# EAGLE design firefly-instrument-controller (EAGLE 7.7.0)

## Sheet 1 of 4
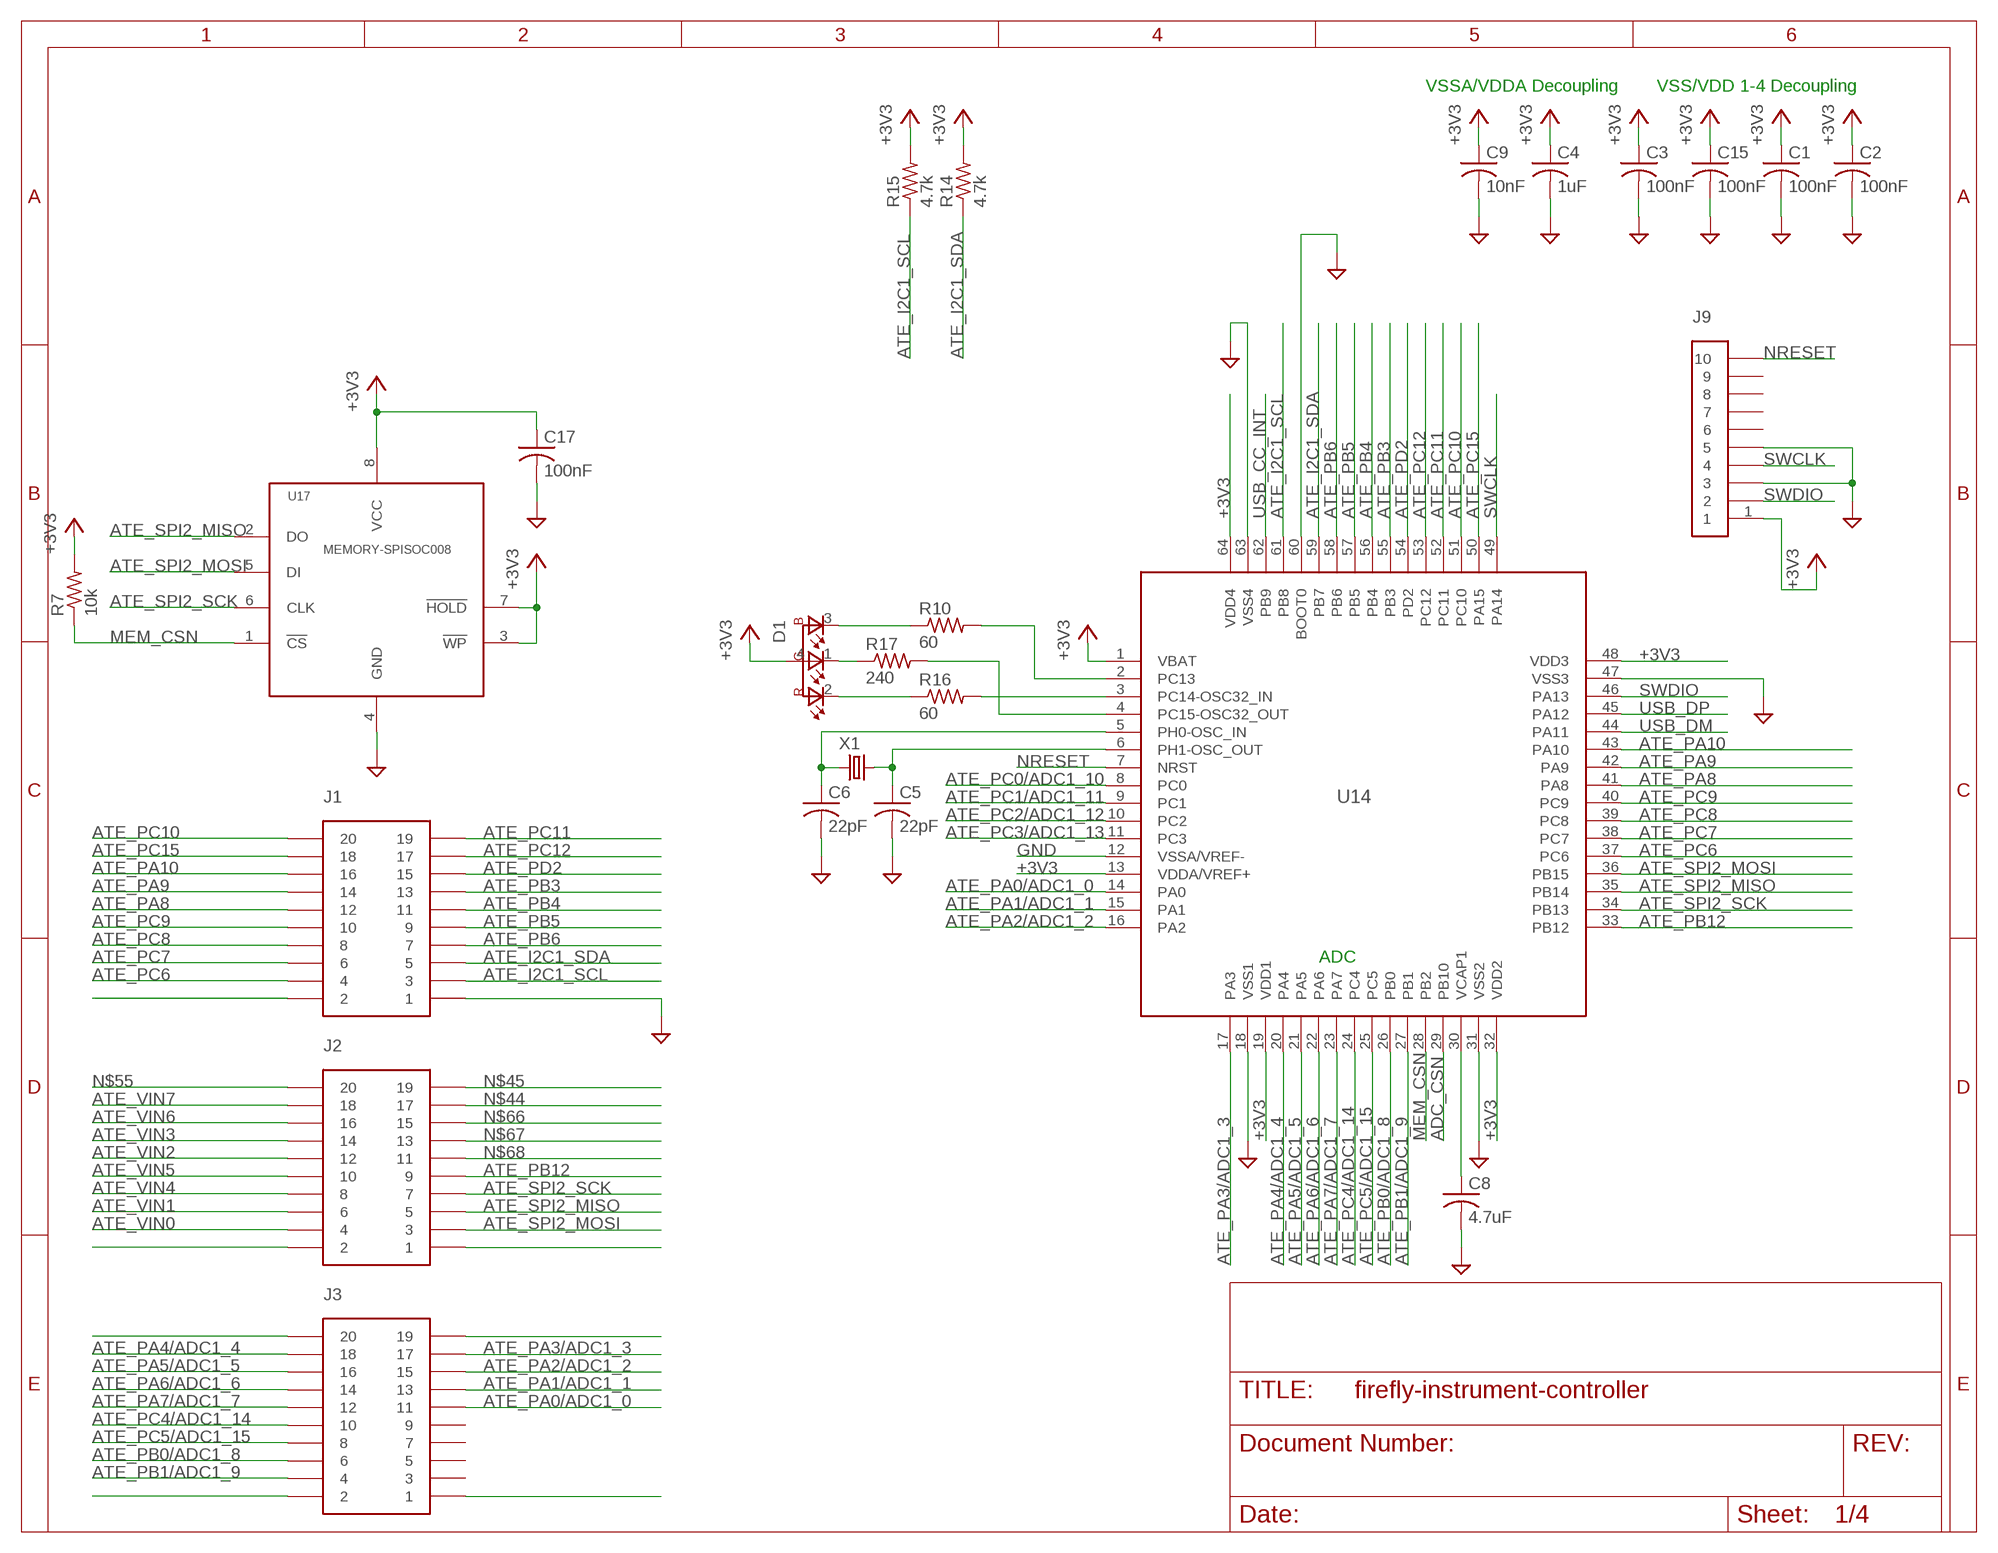
[diagram p0: schematic, sheet 1]

### Parts
C1  100nF  C-USC0805  [C0805]
C2  100nF  C-USC0805  [C0805]
C3  100nF  C-USC0805  [C0805]
C4  1uF  C-USC0805  [C0805]
C5  22pF  C-USC0805  [C0805]
C6  22pF  C-USC0805  [C0805]
C8  4.7uF  C-USC0805  [C0805]
C9  10nF  C-USC0805  [C0805]
C15  100nF  C-USC0805  [C0805]
C17  100nF  C-USC0805  [C0805]
D1  LED-RGB-CAMSL0201RGB  [MSL0201RGB]
J1  CON-200.05"  [CON-HEADER-2X10-0.05]
J2  CON-200.05"  [CON-HEADER-2X10-0.05]
J3  CON-200.05"  [CON-HEADER-2X10-0.05]
J9  CON-10SWD  [SWD-10]
R7  10k  R-USR0805  [R0805]
R10  60  R-USR0805  [R0805]
R14  4.7k  R-USR0805  [R0805]
R15  4.7k  R-USR0805  [R0805]
R16  60  R-USR0805  [R0805]
R17  240  R-USR0805  [R0805]
U14  STM32F411-LQFP64  [LQFP-64]
U17  MEMORY-SPISOC008  [SOC008]
X1  XTAL2TXC_7A  [TXC_7A]

### Nets
+3V3: C1.1 C2.1 C3.1 C4.1 C9.1 C15.1 C17.1 D1.4(A) J9.1 R7.2 R14.2 R15.2 U14.1(VBAT) U14.13(VDDA/VREF+) U14.19(VDD1) U14.32(VDD2) U14.48(VDD3) U14.64(VDD4) U17.3(!WP) U17.7(!HOLD) U17.8(VCC) ; also sheet 2,3,4
ADC_CSN: U14.29(PB10) ; also sheet 2
ATE_I2C1_SCL: J1.3 R15.1 U14.61(PB8) ; also sheet 4
ATE_I2C1_SDA: J1.5 R14.1 U14.59(PB7) ; also sheet 4
ATE_PA0/ADC1_0: J3.11 U14.14(PA0)
ATE_PA1/ADC1_1: J3.13 U14.15(PA1)
ATE_PA2/ADC1_2: J3.15 U14.16(PA2)
ATE_PA3/ADC1_3: J3.17 U14.17(PA3)
ATE_PA4/ADC1_4: J3.18 U14.20(PA4)
ATE_PA5/ADC1_5: J3.16 U14.21(PA5)
ATE_PA6/ADC1_6: J3.14 U14.22(PA6)
ATE_PA7/ADC1_7: J3.12 U14.23(PA7)
ATE_PA8: J1.12 U14.41(PA8)
ATE_PA9: J1.14 U14.42(PA9)
ATE_PA10: J1.16 U14.43(PA10)
ATE_PB0/ADC1_8: J3.6 U14.26(PB0)
ATE_PB1/ADC1_9: J3.4 U14.27(PB1)
ATE_PB3: J1.13 U14.55(PB3)
ATE_PB4: J1.11 U14.56(PB4)
ATE_PB5: J1.9 U14.57(PB5)
ATE_PB6: J1.7 U14.58(PB6)
ATE_PB12: J2.9 U14.33(PB12)
ATE_PC0/ADC1_10: U14.8(PC0)
ATE_PC1/ADC1_11: U14.9(PC1)
ATE_PC2/ADC1_12: U14.10(PC2)
ATE_PC3/ADC1_13: U14.11(PC3)
ATE_PC4/ADC1_14: J3.10 U14.24(PC4)
ATE_PC5/ADC1_15: J3.8 U14.25(PC5)
ATE_PC6: J1.4 U14.37(PC6)
ATE_PC7: J1.6 U14.38(PC7)
ATE_PC8: J1.8 U14.39(PC8)
ATE_PC9: J1.10 U14.40(PC9)
ATE_PC10: J1.20 U14.51(PC10)
ATE_PC11: J1.19 U14.52(PC11)
ATE_PC12: J1.17 U14.53(PC12)
ATE_PC15: J1.18 U14.50(PA15)
ATE_PD2: J1.15 U14.54(PD2)
ATE_SPI2_MISO: J2.5 U14.35(PB14) U17.2(DO) ; also sheet 2
ATE_SPI2_MOSI: J2.3 U14.36(PB15) U17.5(DI) ; also sheet 2
ATE_SPI2_SCK: J2.7 U14.34(PB13) U17.6(CLK) ; also sheet 2
ATE_VIN0: J2.4 ; also sheet 2
ATE_VIN1: J2.6 ; also sheet 2
ATE_VIN2: J2.12 ; also sheet 2
ATE_VIN3: J2.14 ; also sheet 2
ATE_VIN4: J2.8 ; also sheet 2
ATE_VIN5: J2.10 ; also sheet 2
ATE_VIN6: J2.16 ; also sheet 2
ATE_VIN7: J2.18 ; also sheet 2
GND: C1.2 C2.2 C3.2 C4.2 C5.2 C6.2 C8.2 C9.2 C15.2 C17.2 J1.1 J9.3 J9.5 U14.12(VSSA/VREF-) U14.18(VSS1) U14.31(VSS2) U14.47(VSS3) U14.60(BOOT0) U14.63(VSS4) U17.4(GND) ; also sheet 2,3,4
MEM_CSN: R7.1 U14.28(PB2) U17.1(!CS)
N$1: R10.2 U14.2(PC13)
N$4: J3.20
N$5: C5.1 U14.6(PH1-OSC_OUT) X1.2
N$6: C6.1 U14.5(PH0-OSC_IN) X1.1
N$7: R16.2 U14.3(PC14-OSC32_IN)
N$8: D1.1(G) R17.1
N$9: D1.2(R) R16.1
N$10: C8.1 U14.30(VCAP1)
N$13: R17.2 U14.4(PC15-OSC32_OUT)
N$15: D1.3(B) R10.1
N$21: J3.2
N$22: J3.19
N$38: J1.2
N$44: J2.17
N$45: J2.19
N$50: J3.1
N$55: J2.20
N$64: J2.2
N$66: J2.15
N$67: J2.13
N$68: J2.11
N$73: J2.1
NRESET: J9.10 U14.7(NRST)
SWCLK: J9.4 U14.49(PA14)
SWDIO: J9.2 U14.46(PA13)
USB_CC_INT: U14.62(PB9) ; also sheet 4
USB_DM: U14.44(PA11) ; also sheet 4
USB_DP: U14.45(PA12) ; also sheet 4
Unconnected: J3.3 J3.5 J3.7 J3.9 J9.6 J9.7 J9.8 J9.9

### Notes on the sheet
- VSSA/VDDA Decoupling | VSS/VDD 1-4 Decoupling
- ADC

## Sheet 2 of 4
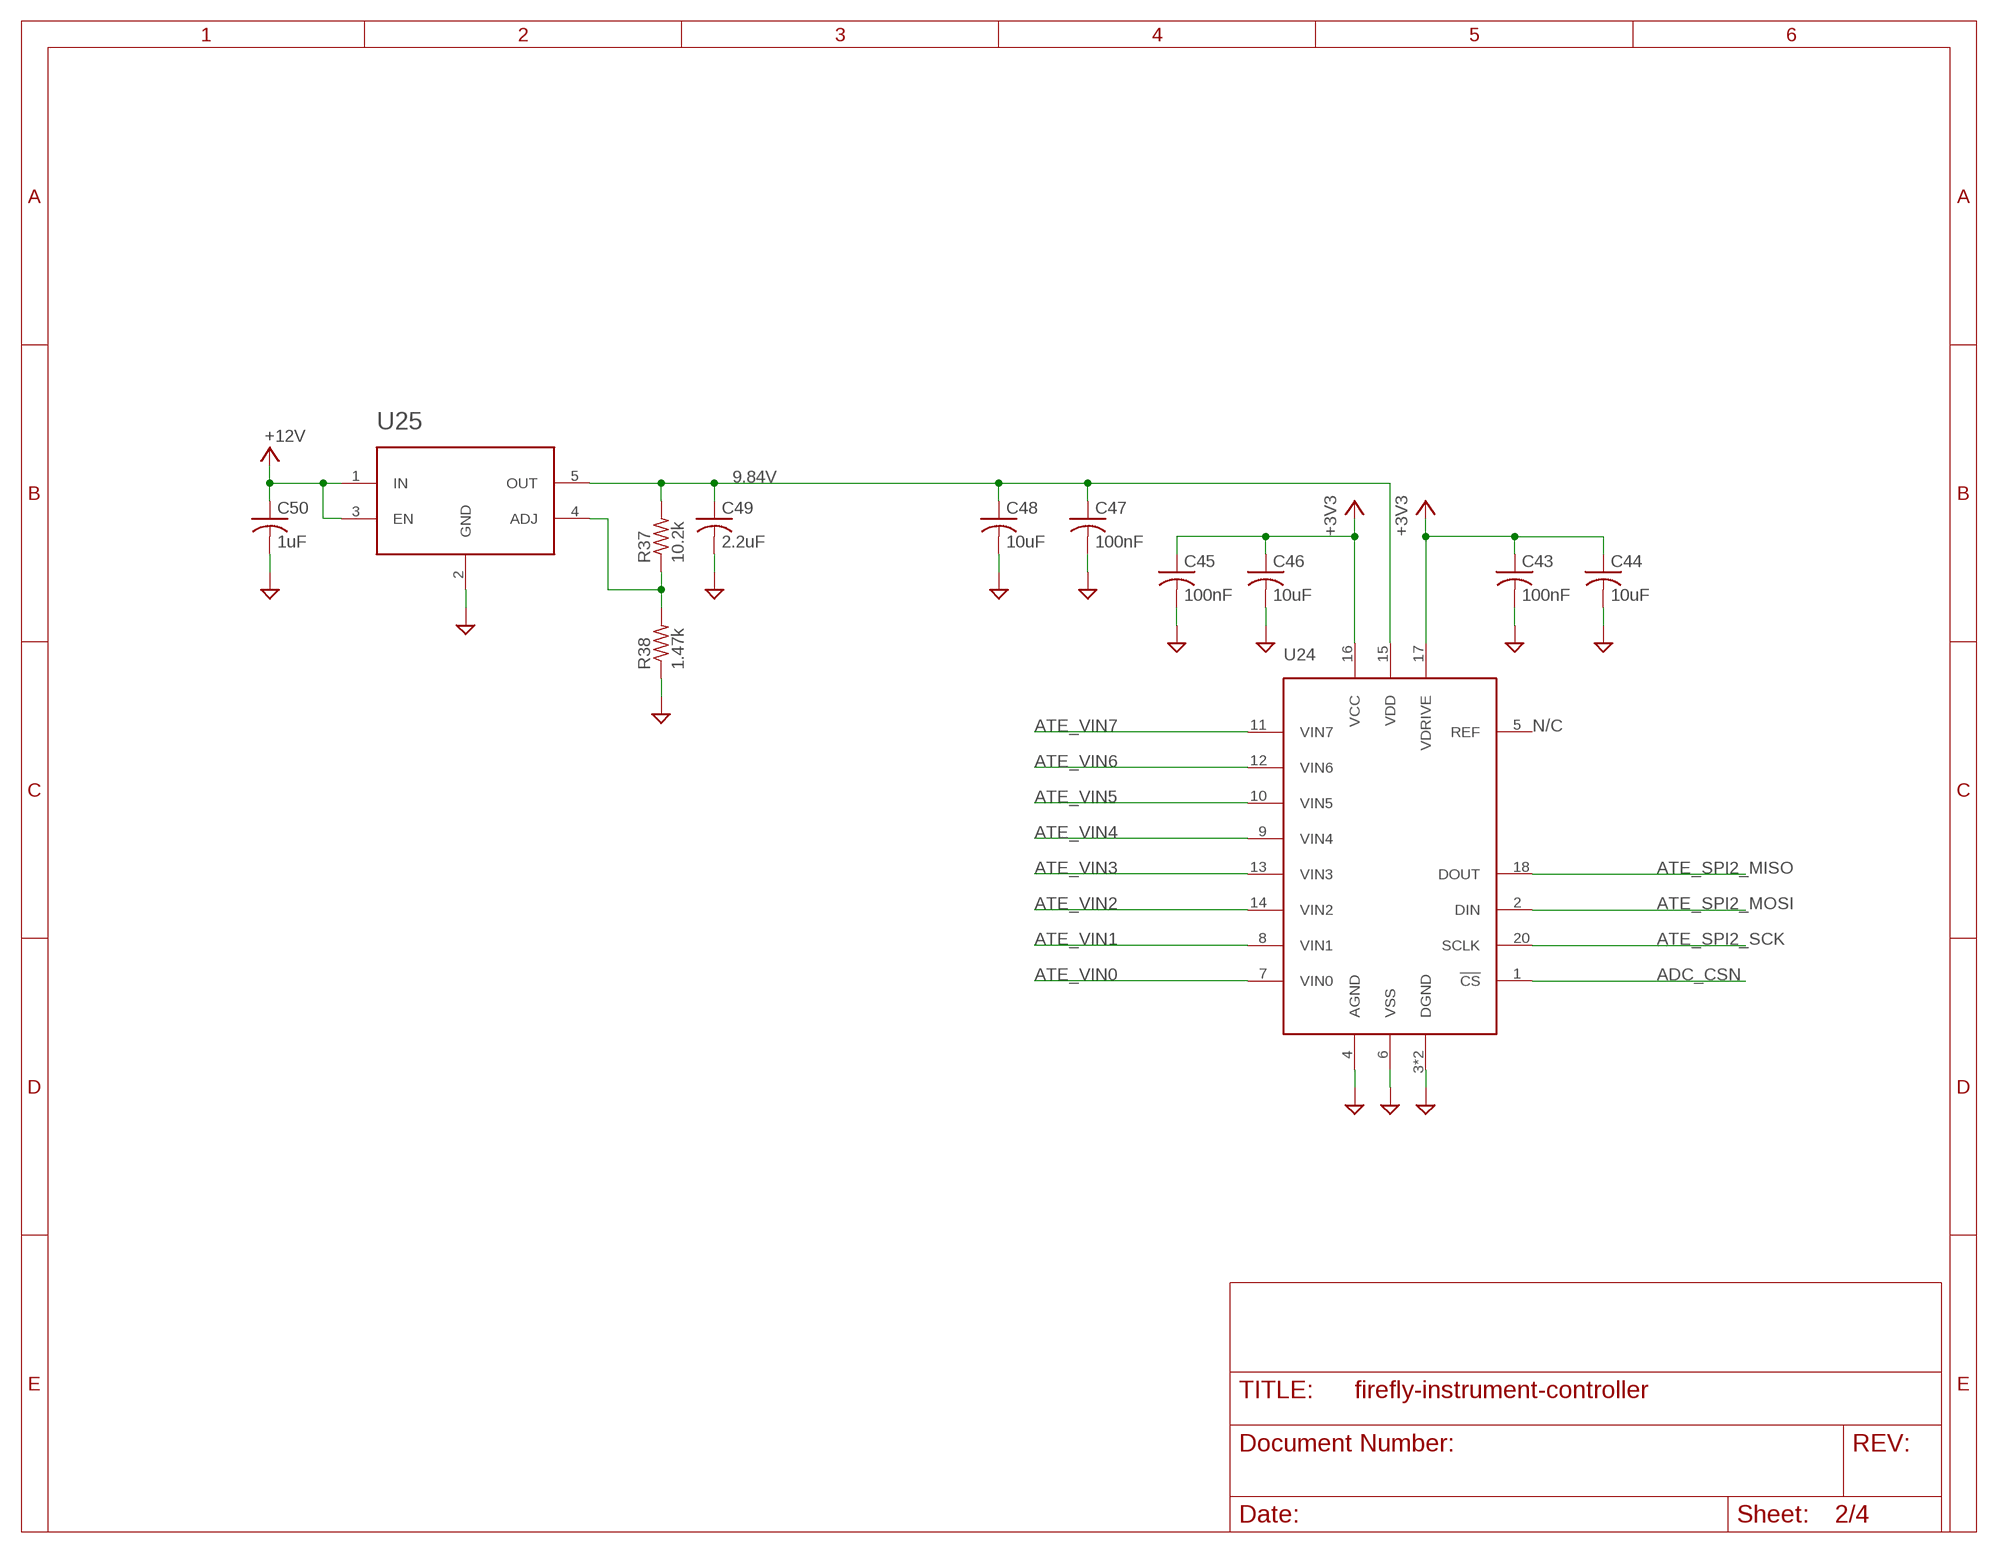
[diagram p1: schematic, sheet 2]

### Parts
C43  100nF  C-USC0805  [C0805]
C44  10uF  C-USC0805  [C0805]
C45  100nF  C-USC0805  [C0805]
C46  10uF  C-USC0805  [C0805]
C47  100nF  C-USC0805  [C0805]
C48  10uF  C-USC0805  [C0805]
C49  2.2uF  C-USC0805  [C0805]
C50  1uF  C-USC0805  [C0805]
R37  10.2k  R-USR0805  [R0805]
R38  1.47k  R-USR0805  [R0805]
U24  AD7327  [TSSOP-20]
U25  VREG-ADJAP2204  [SOT-23-5]

### Nets
+3V3: C43.1 C44.1 C45.1 C46.1 U24.16(VCC) U24.17(VDRIVE) ; also sheet 1,3,4
+12V: C50.1 U25.1(IN) U25.3(EN) ; also sheet 3
ADC_CSN: U24.1(!CS) ; also sheet 1
ATE_SPI2_MISO: U24.18(DOUT) ; also sheet 1
ATE_SPI2_MOSI: U24.2(DIN) ; also sheet 1
ATE_SPI2_SCK: U24.20(SCLK) ; also sheet 1
ATE_VIN0: U24.7(VIN0) ; also sheet 1
ATE_VIN1: U24.8(VIN1) ; also sheet 1
ATE_VIN2: U24.14(VIN2) ; also sheet 1
ATE_VIN3: U24.13(VIN3) ; also sheet 1
ATE_VIN4: U24.9(VIN4) ; also sheet 1
ATE_VIN5: U24.10(VIN5) ; also sheet 1
ATE_VIN6: U24.12(VIN6) ; also sheet 1
ATE_VIN7: U24.11(VIN7) ; also sheet 1
GND: C43.2 C44.2 C45.2 C46.2 C47.2 C48.2 C49.2 C50.2 R38.1 U24.3(DGND) U24.4(AGND) U24.6(VSS) U24.19(DGND) U25.2(GND) ; also sheet 1,3,4
N$47: C47.1 C48.1 C49.1 R37.2 U24.15(VDD) U25.5(OUT)
N$49: R37.1 R38.2 U25.4(ADJ)
Unconnected: U24.5(REF)

### Notes on the sheet
- 9.84V
- N/C

## Sheet 3 of 4
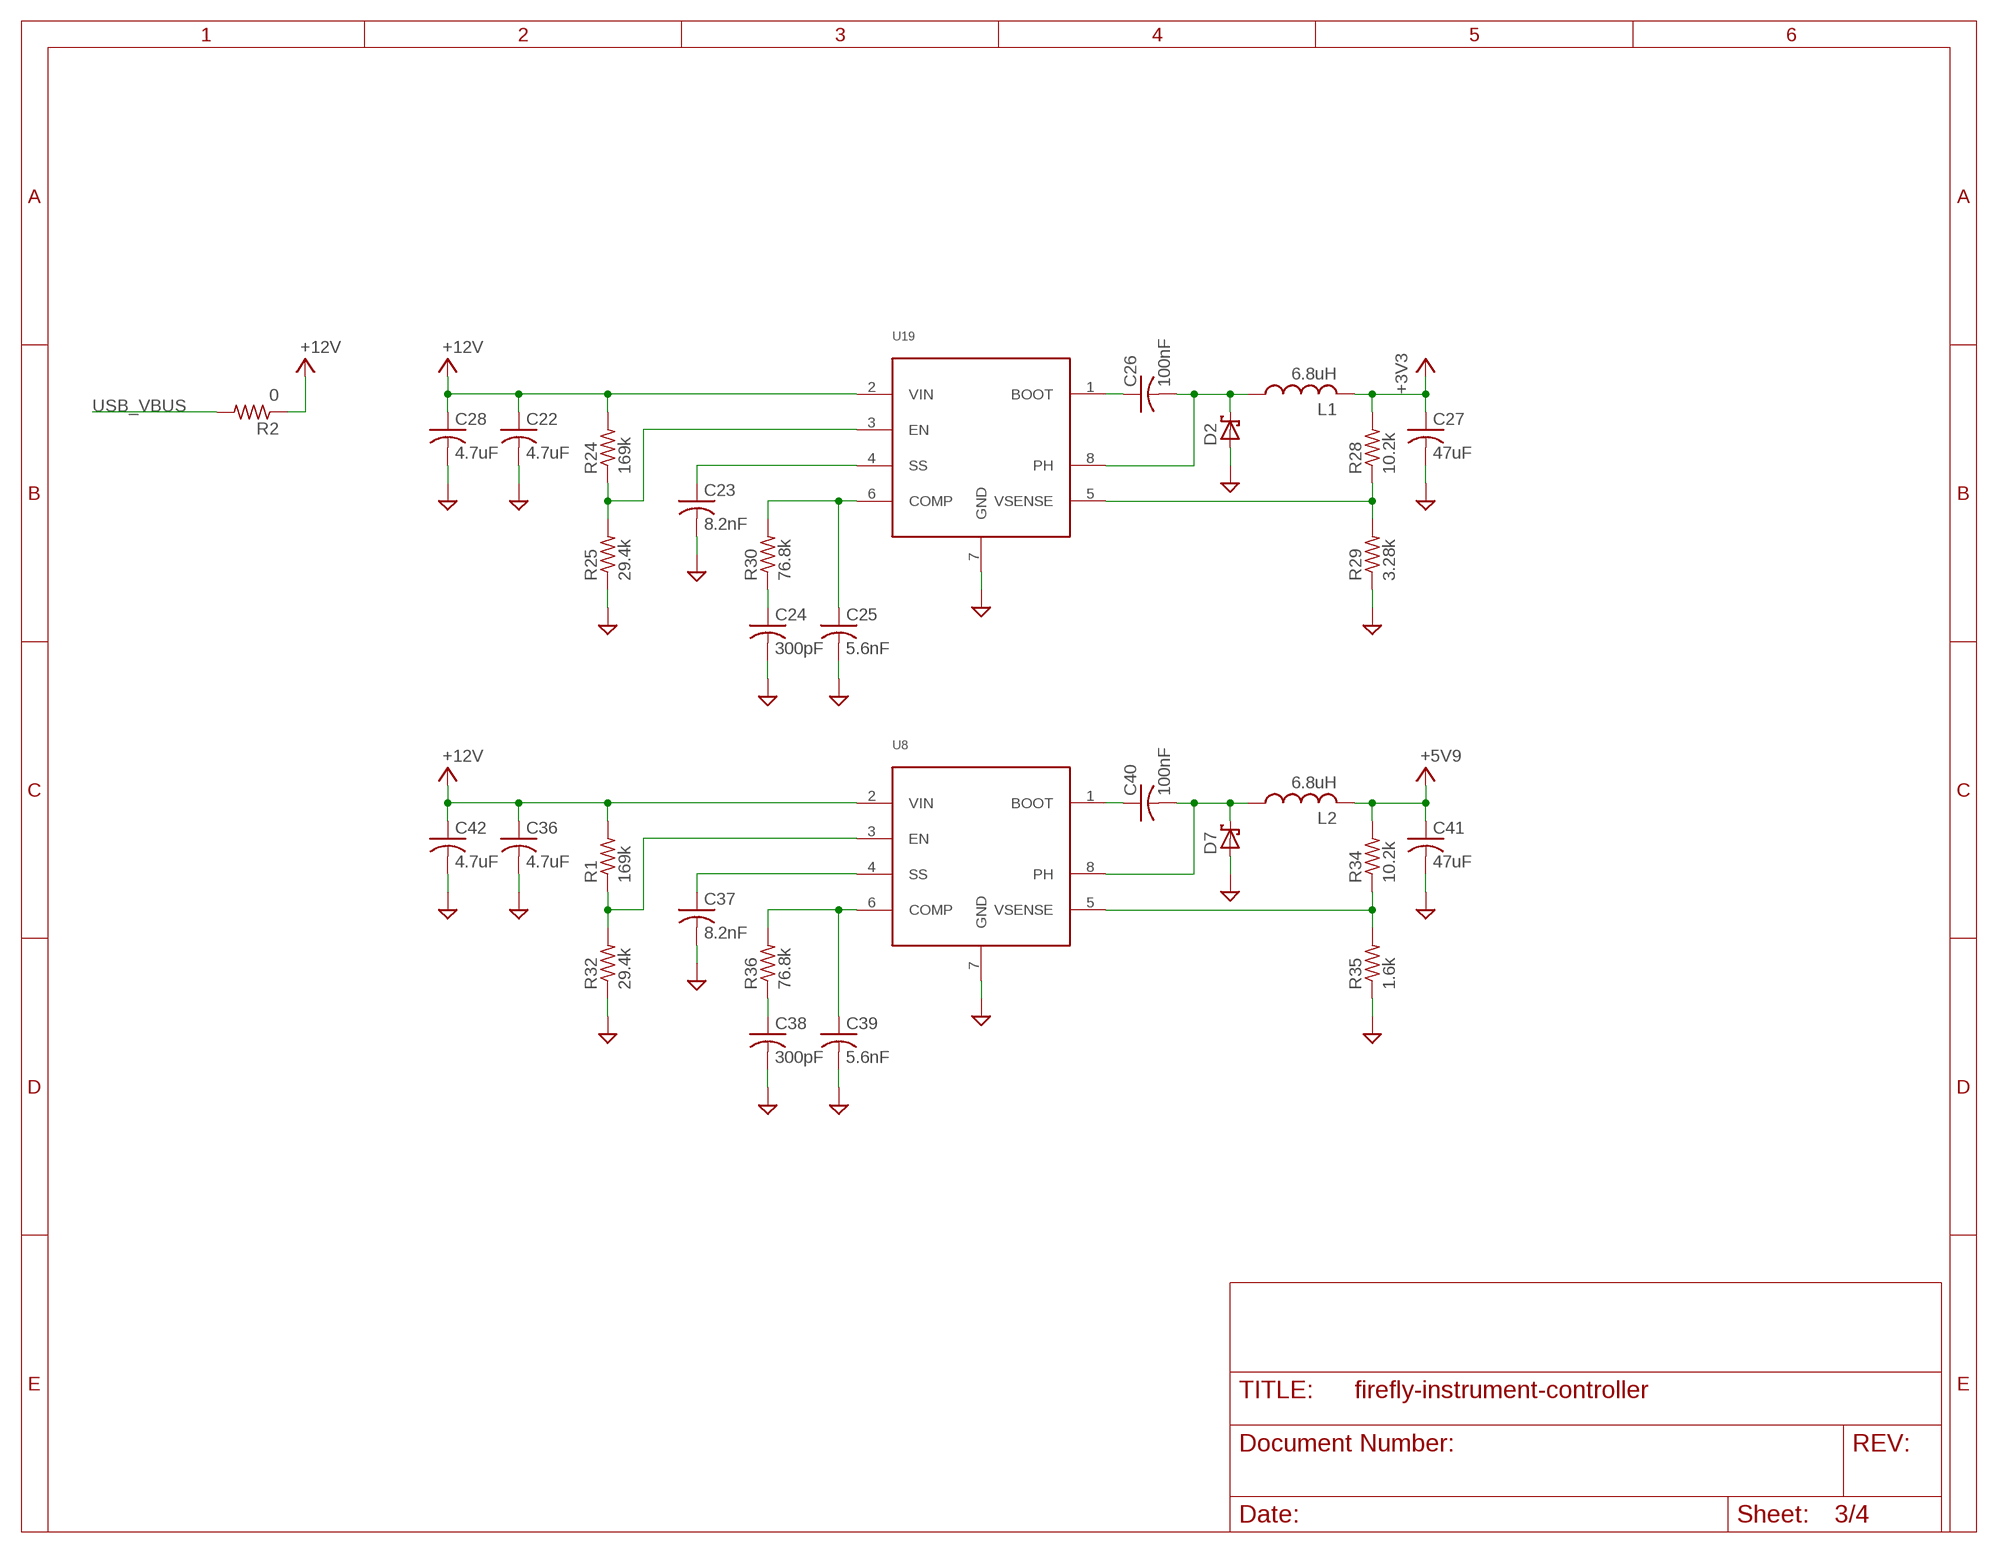
[diagram p2: schematic, sheet 3]

### Parts
C22  4.7uF  C-USC1210  [C1210]
C23  8.2nF  C-USC0805  [C0805]
C24  300pF  C-USC0805  [C0805]
C25  5.6nF  C-USC0805  [C0805]
C26  100nF  C-USC0805  [C0805]
C27  47uF  C-USC1206  [C1206]
C28  4.7uF  C-USC1210  [C1210]
C36  4.7uF  C-USC1210  [C1210]
C37  8.2nF  C-USC0805  [C0805]
C38  300pF  C-USC0805  [C0805]
C39  5.6nF  C-USC0805  [C0805]
C40  100nF  C-USC0805  [C0805]
C41  47uF  C-USC1206  [C1206]
C42  4.7uF  C-USC1210  [C1210]
D2  D-USDO-214AB  [DO-214AB]
D7  D-USDO-214AB  [DO-214AB]
L1  6.8uH  INDUCTORSDR0805  [SDR0805]
L2  6.8uH  INDUCTORSDR0805  [SDR0805]
R1  169k  R-USR0805  [R0805]
R2  0  R-USR0805  [R0805]
R24  169k  R-USR0805  [R0805]
R25  29.4k  R-USR0805  [R0805]
R28  10.2k  R-USR0805  [R0805]
R29  3.28k  R-USR0805  [R0805]
R30  76.8k  R-USR0805  [R0805]
R32  29.4k  R-USR0805  [R0805]
R34  10.2k  R-USR0805  [R0805]
R35  1.6k  R-USR0805  [R0805]
R36  76.8k  R-USR0805  [R0805]
U8  TPS54232  [R-PDSO-G8]
U19  TPS54232  [R-PDSO-G8]

### Nets
+3V3: C27.1 L1.2 R28.2 ; also sheet 1,2,4
+5V9: C41.1 L2.2 R34.2
+12V: C22.1 C28.1 C36.1 C42.1 R1.2 R2.1 R24.2 U8.2(VIN) U19.2(VIN) ; also sheet 2
GND: C22.2 C23.2 C24.2 C25.2 C27.2 C28.2 C36.2 C37.2 C38.2 C39.2 C41.2 C42.2 D2.A D7.A R25.1 R29.1 R32.1 R35.1 U8.7(GND) U19.7(GND) ; also sheet 1,2,4
N$2: C40.1 U8.1(BOOT)
N$3: C40.2 D7.C L2.1 U8.8(PH)
N$28: C26.1 U19.1(BOOT)
N$29: C26.2 D2.C L1.1 U19.8(PH)
N$31: R28.1 R29.2 U19.5(VSENSE)
N$32: C25.1 R30.2 U19.6(COMP)
N$33: C24.1 R30.1
N$34: C23.1 U19.4(SS)
N$35: R24.1 R25.2 U19.3(EN)
N$39: R34.1 R35.2 U8.5(VSENSE)
N$40: C39.1 R36.2 U8.6(COMP)
N$41: C38.1 R36.1
N$42: C37.1 U8.4(SS)
N$43: R1.1 R32.2 U8.3(EN)
USB_VBUS: R2.2 ; also sheet 4

## Sheet 4 of 4
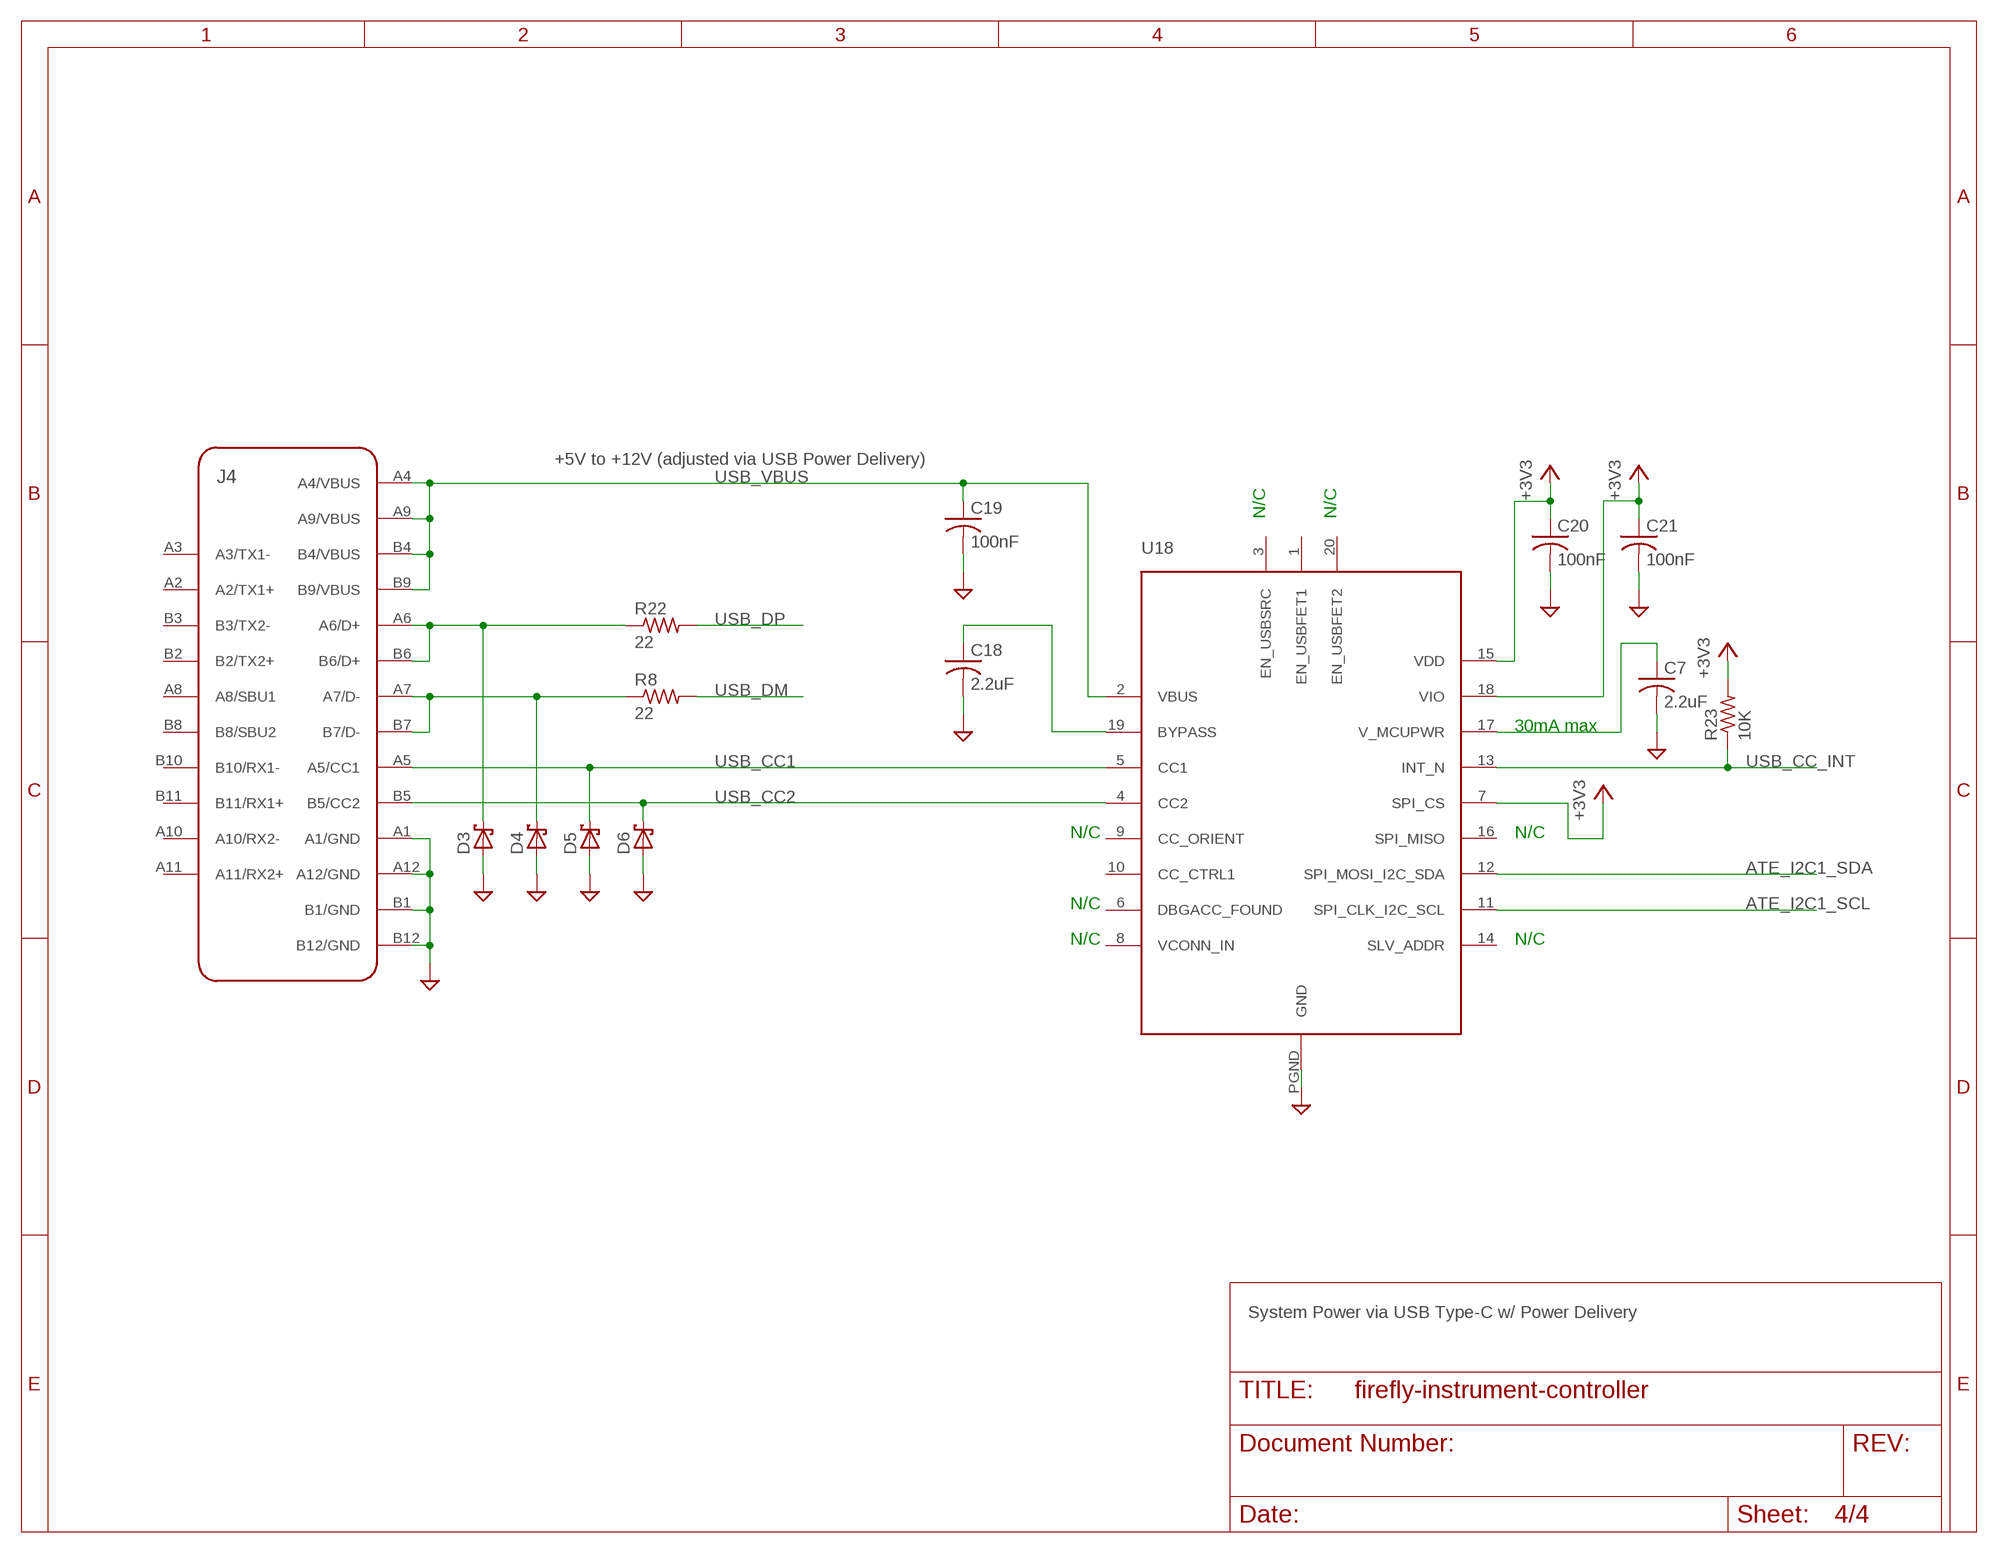
[diagram p3: schematic, sheet 4]

### Parts
C7  2.2uF  C-USC0805  [C0805]
C18  2.2uF  C-USC0805  [C0805]
C19  100nF  C-USC0805  [C0805]
C20  100nF  C-USC0805  [C0805]
C21  100nF  C-USC0805  [C0805]
D3  D-USSMM4FXXA  [SMM4FXXA]
D4  D-USSMM4FXXA  [SMM4FXXA]
D5  D-USSMM4FXXA  [SMM4FXXA]
D6  D-USSMM4FXXA  [SMM4FXXA]
J4  USB-CAUSB1-DFN-PTR3  [AUSB1-DFN-PTR3]
R8  22  R-USR0805  [R0805]
R22  22  R-USR0805  [R0805]
R23  10K  R-USR0805  [R0805]
U18  PTN5100  [HVQFN20]

### Nets
+3V3: C20.1 C21.1 R23.2 U18.7(SPI_CS) U18.15(VDD) U18.18(VIO) ; also sheet 1,2,3
ATE_I2C1_SCL: U18.11(SPI_CLK_I2C_SCL) ; also sheet 1
ATE_I2C1_SDA: U18.12(SPI_MOSI_I2C_SDA) ; also sheet 1
GND: C7.2 C18.2 C19.2 C20.2 C21.2 D3.A D4.A D5.A D6.A J4.A1(A1/GND) J4.A12(A12/GND) J4.B1(B1/GND) J4.B12(B12/GND) U18.PGND(GND) ; also sheet 1,2,3
N$23: C18.1 U18.19(BYPASS)
N$27: C7.1 U18.17(V_MCUPWR)
USB_CC1: D5.C J4.A5(A5/CC1) U18.5(CC1)
USB_CC2: D6.C J4.B5(B5/CC2) U18.4(CC2)
USB_CC_INT: R23.1 U18.13(INT_N) ; also sheet 1
USB_DM: R8.2 ; also sheet 1
USB_DP: R22.2 ; also sheet 1
USB_VBUS: C19.1 J4.A4(A4/VBUS) J4.A9(A9/VBUS) J4.B4(B4/VBUS) J4.B9(B9/VBUS) U18.2(VBUS) ; also sheet 3
USBC_DM: D4.C J4.A7(A7/D-) J4.B7(B7/D-) R8.1
USBC_DP: D3.C J4.A6(A6/D+) J4.B6(B6/D+) R22.1
Unconnected: J4.A2(A2/TX1+) J4.A3(A3/TX1-) J4.A8(A8/SBU1) J4.A10(A10/RX2-) J4.A11(A11/RX2+) J4.B2(B2/TX2+) J4.B3(B3/TX2-) J4.B8(B8/SBU2) J4.B10(B10/RX1-) J4.B11(B11/RX1+) U18.1(EN_USBFET1) U18.3(EN_USBSRC) U18.6(DBGACC_FOUND) U18.8(VCONN_IN) U18.9(CC_ORIENT) U18.10(CC_CTRL1) U18.14(SLV_ADDR) U18.16(SPI_MISO) U18.20(EN_USBFET2)

### Notes on the sheet
- +5V to +12V (adjusted via USB Power Delivery)
- N/C | N/C
- 30mA max
- N/C | N/C
- N/C
- N/C | N/C
- System Power via USB Type-C w/ Power Delivery

## Library data of the parts
C1-C3 C15 C17 C19-C21 C26 C40 C43 C45 C47 = firefly:C-US: CAPACITOR, American symbol; MANUFACTURER: AVX Corporation; ORDERING-CODE: 08055C104KAT2A
C4 = firefly:C-US: CAPACITOR, American symbol; MANUFACTURER: Yageo; ORDERING-CODE: CC0805KKX7R7BB105
C5 C6 = firefly:C-US: CAPACITOR, American symbol; MANUFACTURER: Samsung Electro-Mechanics America, Inc.; ORDERING-CODE: CL21C220FBANNNC
C7 C18 C49 = firefly:C-US: CAPACITOR, American symbol
C8 = firefly:C-US: CAPACITOR, American symbol; MANUFACTURER: Murata Electronics North America; ORDERING-CODE: GRM21BR61E475KA12L
C9 = firefly:C-US: CAPACITOR, American symbol; MANUFACTURER: AVX Corporation; ORDERING-CODE: 08055C103KAT2A
C22 C28 C36 C42 = firefly:C-US: CAPACITOR, American symbol; MANUFACTURER: Murata Electronics North America; ORDERING-CODE: GRM32ER71H475KA88L
C23 C37 = firefly:C-US: CAPACITOR, American symbol; MANUFACTURER: Murata Electronics North America; ORDERING-CODE: GRM21BR72A822KA01L
C24 C38 = firefly:C-US: CAPACITOR, American symbol; MANUFACTURER: Samsung Electro-Mechanics America, Inc.; ORDERING-CODE: CL21B301KBANNNC
C25 C39 = firefly:C-US: CAPACITOR, American symbol; MANUFACTURER: Yageo; ORDERING-CODE: CC0805KRX7R9BB562
C27 C41 = firefly:C-US: CAPACITOR, American symbol; MANUFACTURER: Murata Electronics North America; ORDERING-CODE: GRM31CC80J476KE18L
C44 C46 C48 = firefly:C-US: CAPACITOR, American symbol; MANUFACTURER: AVX Corporation; ORDERING-CODE: 0805YD106KAT2A
C50 = firefly:C-US: CAPACITOR, American symbol; MANUFACTURER: Samsung Electro-Mechanics America, Inc.; ORDERING-CODE: CL21B105KAFNNNG
D1 = firefly:LED-RGB-CA; MANUFACTURER: Rohm Semiconductor; ORDERING-CODE: MSL0201RGBW1
D2 D7 = firefly:D-US; MANUFACTURER: Vishay Semiconductor Diodes Division; ORDERING-CODE: SL44-E3/57T
D3-D6 = firefly:D-US; MANUFACTURER: STMicroelectronics; ORDERING-CODE: SMM4F24A-TR
J1-J3 = firefly:CON-20
J4 = firefly:USB-C; MANUFACTURER: Assmann WSW Components; ORDERING-CODE: AUSB1-DFN-PTR3
J9 = firefly:CON-10; MAUFACTURER: Harwin; ORDERING-CODE: M50-3500542
L1 L2 = firefly:INDUCTOR; MANUFACTURER: Bourns Inc.; ORDERING-CODE: SDR0805-6R8ML
R1 R24 = firefly:R-US: RESISTOR, American symbol; MANUFACTURER: Yageo; ORDERING-CODE: RC0805FR-07169KL
R2 = firefly:R-US: RESISTOR, American symbol; MANUFACTURER: Yageo; ORDERING-CODE: RC0805FR-070RL
R7 R23 = firefly:R-US: RESISTOR, American symbol; MANUFACTURER: Yageo; ORDERING-CODE: RC0805FR-0710KL
R8 R22 = firefly:R-US: RESISTOR, American symbol; MANUFACTURER: Yageo; ORDERING-CODE: RC0805FR-0722RL
R10 R16 = firefly:R-US: RESISTOR, American symbol; MANUFACTURER: Yageo; ORDERING-CODE: RC0805FR-0760R4L
R14 R15 = firefly:R-US: RESISTOR, American symbol; MANUFACTURER: Yageo; ORDERING-CODE: RC0805FR-074K7L
R17 = firefly:R-US: RESISTOR, American symbol; MANUFACTURER: Yageo; ORDERING-CODE: RC0805FR-07240RL
R25 R32 = firefly:R-US: RESISTOR, American symbol; MANUFACTURER: Yageo; ORDERING-CODE: RC0805FR-0729K4L
R28 R34 R37 = firefly:R-US: RESISTOR, American symbol; MANUFACTURER: Yageo; ORDERING-CODE: RT0805DRE0710K2L
R29 = firefly:R-US: RESISTOR, American symbol; MANUFACTURER: Yageo; ORDERING-CODE: RT0805BRD073K28L
R30 R36 = firefly:R-US: RESISTOR, American symbol; MANUFACTURER: Yageo; ORDERING-CODE: RC0805FR-0776K8L
R35 = firefly:R-US: RESISTOR, American symbol; MANUFACTURER: Yageo; ORDERING-CODE: RT0805BRD071K6L
R38 = firefly:R-US: RESISTOR, American symbol; MANUFACTURER: Yageo; ORDERING-CODE: RT0805DRE071K47L
U8 U19 = firefly:TPS54232; MANUFACTURER: Texas Instruments; ORDERING-CODE: TPS54232DR
U14 = firefly:STM32F411-LQFP64; MANUFACTURER: STMicroelectronics; ORDERING-CODE: STM32F411RET6
U17 = firefly:MEMORY-SPI; MANUFACTURER: Adesto Technologies; ORDERING-CODE: AT25SF161-SSHD-T
U18 = firefly:PTN5100; MANUFACTURER: NXP USA Inc.; ORDERING-CODE: PTN5100ABS
U24 = firefly:AD7327
U25 = firefly:VREG-ADJ; MANUFACTURER: Diodes Incorporated; ORDERING-CODE: AP2204K-ADJTRG1
X1 = firefly:XTAL2; MANUFACTURER: TXC CORPORATION; ORDERING-CODE: 7A-8.000MAAE-T

## Board
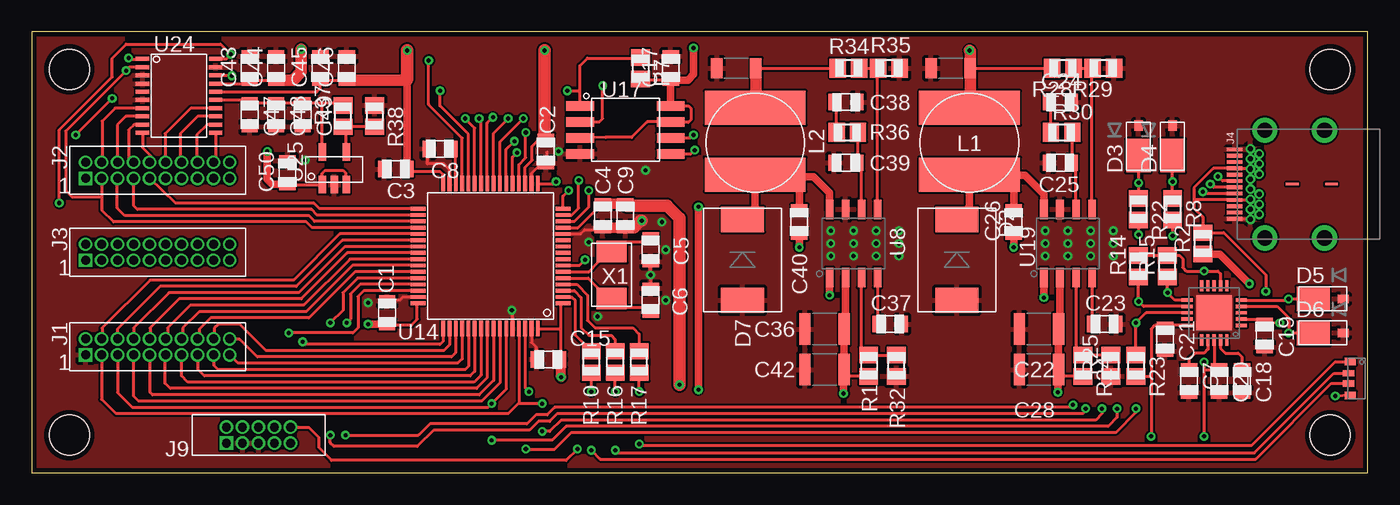
[diagram p4: board, top side]
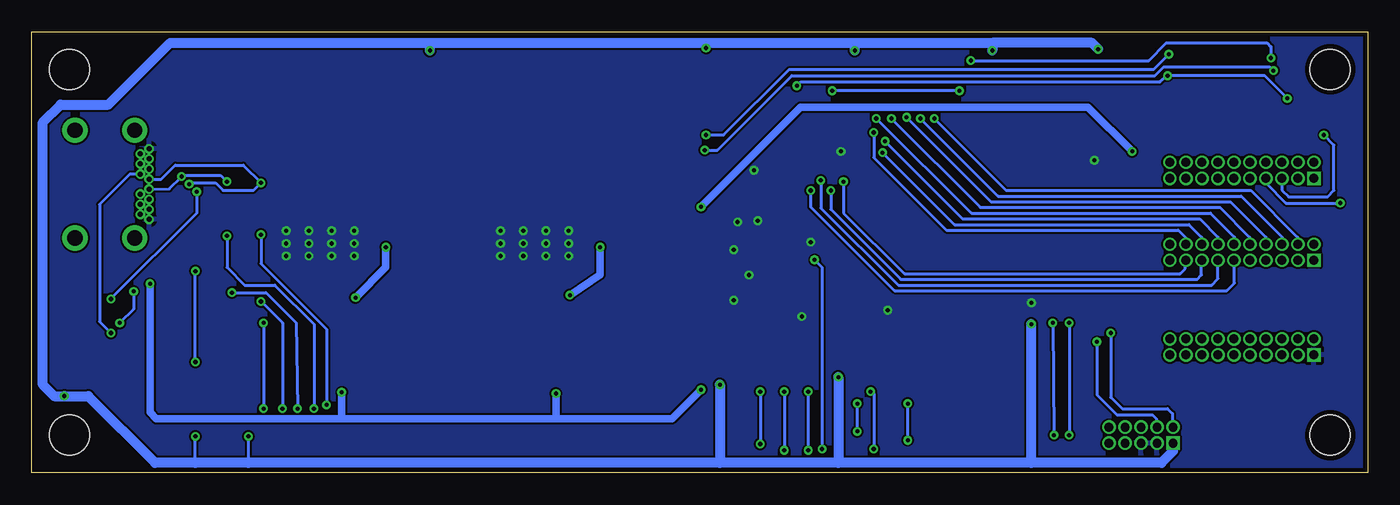
[diagram p5: board, bottom side, seen from below]

Size 106 x 35 mm. Coordinates in mm from the lower left corner, seen from the top.
Outline: 0,0 106,0 106,35 0,35 0,0
Copper layers (1*16): Top 0.0356mm / dielectric 1.5011mm / Bottom 0.0356mm
Design rules "LaenPCBOrder": minimum track width 6mil, minimum drill 13mil, track to track 6mil, track to pad 6mil, pad to pad 6mil, via to via 6mil, smd to smd 6mil, copper to edge 15mil, drill to drill 6mil, minimum pad ring 7mil, minimum via ring 7mil, stop-mask expansion 3mil, vias tented up to drill 0mil, thermal gap 10mil
Holes 3.2 mm at 3,3 3,32 103,32 103,3

### Footprints (pad centres in the part's own frame; a part is rotated, then mirrored left to right if it is on the bottom)
C0805 = smd 0.9 x 1.3: 1 -0.95,0; 2 0.95,0
C1210 = smd 0.9 x 2.5: 1 -1.55,0; 2 1.55,0
C1206 = smd 0.9 x 1.6: 1 -1.55,0; 2 1.55,0
MSL0201RGB = smd 0.6 x 0.9: 1 -1.35,0; 4 1.35,0 | smd 0.5 x 0.9: 2 -0.4,-0.15; 3 0.4,-0.15
DO-214AB = smd 2 x 3.4: A 3.2,0; C -3.2,0
SMM4FXXA = smd 0.85 x 0.65: A 1.64,0 | smd 2.65 x 1.95: C -0.74,0
CON-HEADER-2X10-0.05 = drill 0.711 pad 1.016 square: 1 -5.715,-0.635 | drill 0.711 pad 1.016: 2 -5.715,0.635; 3 -4.445,-0.635; 4 -4.445,0.635; 5 -3.175,-0.635; 6 -3.175,0.635; 7 -1.905,-0.635; 8 -1.905,0.635; 9 -0.635,-0.635; 10 -0.635,0.635; 11 0.635,-0.635; 12 0.635,0.635; 13 1.905,-0.635; 14 1.905,0.635; 15 3.175,-0.635; 16 3.175,0.635; 17 4.445,-0.635; 18 4.445,0.635; 19 5.715,-0.635; 20 5.715,0.635
AUSB1-DFN-PTR3 = smd 0.3 x 1.2: A1 -2.75,10.58; A2 -2.25,10.58; A3 -1.75,10.58; A4 -1.25,10.58; A5 -0.75,10.58; A6 -0.25,10.58; A7 0.25,10.58; A8 0.75,10.58; A9 1.25,10.58; A10 1.75,10.58; A11 2.25,10.58; A12 2.75,10.58 | drill 0.4 pad 0.65: B1 2.8,9.33; B2 2.4,8.63; B3 1.6,8.63; B4 1.2,9.33; B5 0.8,8.63; B6 0.4,9.33; B7 -0.4,9.33; B8 -0.8,8.63; B9 -1.2,9.33; B10 -1.6,8.63; B11 -2.4,8.63; B12 -2.8,9.33; GNDP1 2,9.33; GNDP2 -2,9.33 | drill 1.2 pad 2: MP1 4.27,8.18; MP2 4.27,3.45; MP3 -4.27,3.45; MP4 -4.27,8.18 | smd 0.2 x 1: MP5 0,6; MP6 0,2.9
SWD-10 = drill 0.7 pad 1 square: 1 -2.54,-0.635 | drill 0.7 pad 1: 2 -2.54,0.635; 3 -1.27,-0.635; 4 -1.27,0.635; 5 0,-0.635; 6 0,0.635; 7 1.27,-0.635; 8 1.27,0.635; 9 2.54,-0.635; 10 2.54,0.635
SDR0805 = smd 8 x 2.7: 1 0,2.65; 2 0,-2.65
R0805 = smd 1.3 x 1.5: 1 -0.85,0; 2 0.85,0
R-PDSO-G8 = smd 1.55 x 0.6: 1 -2.7,1.905; 2 -2.7,0.635; 3 -2.7,-0.635; 4 -2.7,-1.905; 5 2.7,-1.905; 6 2.7,-0.635; 7 2.7,0.635; 8 2.7,1.905
LQFP-64 = smd 1.2 x 0.3: 1 -5.75,3.75; 2 -5.75,3.25; 3 -5.75,2.75; 4 -5.75,2.25; 5 -5.75,1.75; 6 -5.75,1.25; 7 -5.75,0.75; 8 -5.75,0.25; 9 -5.75,-0.25; 10 -5.75,-0.75; 11 -5.75,-1.25; 12 -5.75,-1.75; 13 -5.75,-2.25; 14 -5.75,-2.75; 15 -5.75,-3.25; 16 -5.75,-3.75; 33 5.75,-3.75; 34 5.75,-3.25; 35 5.75,-2.75; 36 5.75,-2.25; 37 5.75,-1.75; 38 5.75,-1.25; 39 5.75,-0.75; 40 5.75,-0.25; 41 5.75,0.25; 42 5.75,0.75; 43 5.75,1.25; 44 5.75,1.75; 45 5.75,2.25; 46 5.75,2.75; 47 5.75,3.25; 48 5.75,3.75 | smd 0.3 x 1.2: 17 -3.75,-5.75; 18 -3.25,-5.75; 19 -2.75,-5.75; 20 -2.25,-5.75; 21 -1.75,-5.75; 22 -1.25,-5.75; 23 -0.75,-5.75; 24 -0.25,-5.75; 25 0.25,-5.75; 26 0.75,-5.75; 27 1.25,-5.75; 28 1.75,-5.75; 29 2.25,-5.75; 30 2.75,-5.75; 31 3.25,-5.75; 32 3.75,-5.75; 49 3.75,5.75; 50 3.25,5.75; 51 2.75,5.75; 52 2.25,5.75; 53 1.75,5.75; 54 1.25,5.75; 55 0.75,5.75; 56 0.25,5.75; 57 -0.25,5.75; 58 -0.75,5.75; 59 -1.25,5.75; 60 -1.75,5.75; 61 -2.25,5.75; 62 -2.75,5.75; 63 -3.25,5.75; 64 -3.75,5.75
SOC008 = smd 2.2 x 0.76: 1 -3.6,1.905; 2 -3.6,0.635; 3 -3.6,-0.635; 4 -3.6,-1.905; 5 3.6,-1.905; 6 3.6,-0.635; 7 3.6,0.635; 8 3.6,1.905
HVQFN20 = smd 0.9 x 0.27: 1 -2.15,1; 2 -2.15,0.5; 3 -2.15,0; 4 -2.15,-0.5; 5 -2.15,-1; 11 2.15,-1; 12 2.15,-0.5; 13 2.15,0; 14 2.15,0.5; 15 2.15,1 | smd 0.27 x 0.9: 6 -1,-2.15; 7 -0.5,-2.15; 8 0,-2.15; 9 0.5,-2.15; 10 1,-2.15; 16 1,2.15; 17 0.5,2.15; 18 0,2.15; 19 -0.5,2.15; 20 -1,2.15 | smd 2.8 x 2.8: PGND 0,0
TSSOP-20 = smd 1.05 x 0.32: 1 -2.9,2.925; 2 -2.9,2.275; 3 -2.9,1.625; 4 -2.9,0.975; 5 -2.9,0.325; 6 -2.9,-0.325; 7 -2.9,-0.975; 8 -2.9,-1.625; 9 -2.9,-2.275; 10 -2.9,-2.925; 11 2.9,-2.925; 12 2.9,-2.275; 13 2.9,-1.625; 14 2.9,-0.975; 15 2.9,-0.325; 16 2.9,0.325; 17 2.9,0.975; 18 2.9,1.625; 19 2.9,2.275; 20 2.9,2.925
SOT-23-5 = smd 1.4 x 0.6: 1 -1.24,0.94; 2 -1.24,-0.01; 3 -1.24,-0.96; 4 1.34,-0.96; 5 1.34,0.94
TXC_7A = smd 1.7 x 2.4: 1 -1.85,0; 2 1.85,0

### Placement (x,y rotation side)
C1  28.2,12.7 90 top
C2  40.8,25.5 270 top
C3  28.9,24.1 180 top
C4  45.3,20.4 270 top
C5  49.1,17.7 270 top
C6  49.1,13.7 90 top
C7  91.8,7.3 270 top
C8  32.4,25.7 180 top
C9  47.1,20.4 270 top
C15  41,9 180 top
C17  50.7,32.1 90 top
C18  96,7.3 270 top
C19  97.8,10.9 270 top
C20  94.2,7.3 270 top
C21  89.9,10.6 270 top
C22  79.9,11.4 180 top
C23  85.1,11.8 0 top
C24  81.6,29.4 0 top
C25  81.6,24.6 180 top
C26  77.9,19.9 90 top
C27  72.9,32.1 180 top
C28  79.9,8.2 180 top
C36  62.9,11.4 180 top
C37  68.1,11.8 0 top
C38  64.6,29.4 0 top
C39  64.6,24.6 180 top
C40  60.9,19.9 90 top
C41  55.9,32.1 180 top
C42  62.9,8.2 180 top
C43  17.3,32.1 90 top
C44  19.4,32.1 90 top
C45  22.9,32.1 90 top
C46  25,32.1 90 top
C47  17.3,28.4 270 top
C48  19.4,28.4 270 top
C49  21.5,28.4 270 top
C50  20.3,23.8 90 top
D1  104.6,7.5 270 top
D2  73.4,16.9 270 top
D3  87.8,25.9 90 top
D4  90.5,25.9 90 top
D5  102.4,13.8 0 top
D6  102.4,11.1 0 top
D7  56.4,16.9 270 top
J1  10,10 0 top
J2  10,24 0 top
J3  10,17.5 0 top
J4  106,22.9 90 top
J9  18,3 0 top
L1  74.4,26.3 180 top
L2  57.4,26.3 180 top
R1  66.4,8.5 270 top
R2  92.9,18.2 90 top
R7  48.3,32.1 270 top
R8  90.5,20.9 270 top
R10  44.4,8.8 90 top
R14  87.8,16.4 90 top
R15  90.1,16.4 90 top
R16  46.3,8.8 90 top
R17  48.2,8.8 90 top
R22  87.8,20.9 270 top
R23  87.6,8.5 270 top
R24  83.4,8.5 270 top
R25  85.6,8.5 90 top
R28  81.8,32.1 180 top
R29  85,32.1 180 top
R30  81.7,27 0 top
R32  68.6,8.5 90 top
R34  64.8,32.1 180 top
R35  68,32.1 180 top
R36  64.7,27 0 top
R37  24.7,28.3 90 top
R38  27.2,28.3 270 top
U8  65.2,18.2 90 top
U14  36.4,17.2 180 top
U17  47.1,27.2 0 top
U18  93.8,12.7 180 top
U19  82.2,18.2 90 top
U24  11.7,29.9 0 top
U25  24,24.1 90 top
X1  46,15.7 90 top

### Tracks (layer width: path | path; a pad name or v marks a point on that pad's centre or on a via)
+3V3  (via drill 0.33)
  Top 0.254: U14.13 43.35,19.45 45.2,21.3 C4.1 | 30.55,13.45 U14.48 30.6,13.4 30.6,12.2 30.15,11.75 C1.1 | U14.19 39.15,24.25 39.7,24.8 39.7,25.9 40.25,26.45 C2.1 40.7,26.65 | U14.32 32.65,23.65 32.4,23.9 29.95,23.9 C3.1 29.8,24.3 | 47.25,21.2 C9.1 | U17.8 52.09,29.11 52.3,28.9 52.3,28 52.1,27.8 50.73,27.8 U17.7 48.84,27.84 47.6,26.6 45.53,26.6 U17.3 | C27.1 R28.2 | C46.1 C45.1 22.9,30.5 22.62,30.23 U24.16 | U24.17 17.12,30.88 C43.1 C44.1 | D1.4 v103.4,6.1 | U18.18 93.8,8.35 C20.1 94.05,8.2 93,8.2 | U18.15 89.6,11.7 | 89.6,11.7 C21.1 | v93,2.9 93,8.2 | 89.6,11.7 89.1,11.7 88.8,11.4 88.8,7.7 | 88.8,7.7 v88.8,2.9 | R23.2 88.75,7.65 88.8,7.7 | R14.2 R15.2 91.05,17.25 91.3,17 91.3,16.3 91.6,16 93.1,16 | 93.1,16 94.1,16 94.3,15.8 U18.7 | C17.1 48.4,31.15 R7.2 | 93,8.2 v93,8.8 | v93,16 93,15.9 93.1,16 | U14.1 41.95,13.45 41.95,11.45 | 41.95,11.45 C15.1 | U14.64 41.95,11.45
  Top 0.6: 29.8,24.3 29.8,31.2 | U17.8 C17.1 52.05,31.15 52.5,31.6 v52.5,33.7 | v26.7,11.8 28.2,11.8 C1.1
  Top 0.8: v42,7.6 42,9 C15.1
  Top 0.813: C4.1 C9.1
  Top 0.9: L1.2 74.45,29 C27.1 74.45,33.45 v74.4,33.5 | C46.1 29.77,31.15 29.8,31.2 | v21.4,33.6 21.4,31.8 20.75,31.15 C44.1
  Top 1: 47.25,21.2 50.4,21.2 51.4,20.2 v51.4,7 | 29.8,31.2 v29.8,33.5 | 40.7,26.65 v40.7,33.5
  Bottom 0.254: v93,2.9 93,0.8 93,0.51 | v88.8,2.9 88.8,0.8 88.8,0.53 | v93,8.8 v93,16
  Bottom 0.6: v52.5,33.7 52.5,34.1
  Bottom 0.8: 29.8,34.1 v29.8,33.5 | 26.7,0.8 16.39,0.8 15.46,1.73 J9.1 | 26.7,0.8 42,0.8 | 42,0.8 51.4,0.8 | 51.4,0.8 88.8,0.8 93,0.8 96.2,0.8 101.5,6.1 v103.4,6.1 104.2,6.1 105.1,7 105.1,27.8 103.7,29.2 99.9,29.2 95,34.1 74.4,34.1 | 26.7,0.8 v26.7,11.8 | v42,7.6 42,0.8 | v51.4,7 51.4,0.8 | 74.4,34.1 52.5,34.1 40.5,34.1 | 40.5,34.1 29.8,34.1 | v74.4,33.5 74.4,34.1 | v40.7,33.5 40.7,33.8 40.5,34.1 | v21.4,33.6 21.9,34.1 29.8,34.1
+5V9
  Top 0.254: C41.1 R34.2
  Top 0.9: C41.1 57.45,29 L2.2
+12V  (via drill 0.33)
  Top 0.254: R1.2 64.5,7.65 64.45,7.6 | R24.2 81.5,7.65 81.45,7.7 | C50.1 U25.1 23.06,23.76 23.3,24 24.7,24 24.9,23.8 24.9,22.92 U25.3
  Top 0.6: U8.2 64.56,11.4 C36.1 C42.1 64.45,7.6 v64.4,6.3 | U19.2 81.56,11.52 C22.1 C28.1 81.45,7.7 v81.4,6.4 | R2.1 94.25,17.35 v96.6,15 | v52.9,6.6 v52.9,21.1 | v18.7,25.5 18.7,23.3 19.1,22.9 20.25,22.9 C50.1
  Bottom 0.6: v96.6,15 96.6,4.8 96.1,4.3 81.4,4.3 | 81.4,4.3 64.4,4.3 | 64.4,4.3 55.2,4.3 v52.9,6.6 | v64.4,6.3 64.4,4.3 | v81.4,6.4 81.4,4.3 | v52.9,21.1 45,29 22.2,29 v18.7,25.5
ADC_CSN  (via drill 0.33)
  Top 0.254: U14.29 34.15,26.55 31.5,29.2 v31.5,32.7 | v7.7,32.9 7.8,32.8 8.78,32.8 U24.1
  Bottom 0.254: v31.5,32.7 17.4,32.7 16,34.1 8,34.1 7.7,33.8 v7.7,32.9
ATE_I2C1_SCL  (via drill 0.33)
  Top 0.254: U14.61 38.65,5.55 | 38.65,5.55 37.8,4.7 6.7,4.7 5.55,5.84 J1.3 | U18.11 90.7,13.7 v90.1,14.3 R15.1 | v84.9,5.1 84.9,4.7 84.4,4.2 42,4.2 41.1,3.3 v40.5,3.3 | v40.5,5.5 38.7,5.5 38.65,5.55
  Bottom 0.254: v90.1,14.3 87.4,14.3 85,11.9 v84.9,5.1 | v40.5,3.3 v40.5,5.5
ATE_I2C1_SDA  (via drill 0.33)
  Top 0.254: U14.59 37.65,6.65 v36.5,5.5 36.2,5.2 8,5.2 6.83,6.38 J1.5 | U18.12 88.2,13.2 v87.8,13.6 R14.1 | v86.1,5.1 86.1,4.4 85.4,3.7 42.4,3.7 41.3,2.6 v36.5,2.6
  Bottom 0.254: v87.8,13.6 86.1,11.9 v86.1,5.1 | v36.5,2.6 v36.5,5.5
ATE_PA0/ADC1_0  (via drill 0.33)
  Top 0.254: U14.14 43.05,19.95 44.2,21.1 v44.2,22.4
  Bottom 0.254: v44.2,22.4 44.2,21.1 37.55,14.45 11.2,14.45 10.6,15.05 10.6,16.83 J3.11
ATE_PA1/ADC1_1  (via drill 0.33)
  Top 0.254: U14.15 42.85,20.45 43.4,21 v43.4,23.2
  Bottom 0.254: v43.4,23.2 43.4,21 37.25,14.9 12.4,14.9 11.9,15.4 J3.13
ATE_PA2/ADC1_2  (via drill 0.33)
  Top 0.254: U14.16 42.15,21.95 v42.6,22.4
  Bottom 0.254: v42.6,22.4 42.6,20.9 37.05,15.35 13.55,15.35 13.2,15.7 13.2,16.84 J3.15
ATE_PA3/ADC1_3  (via drill 0.33)
  Top 0.254: U14.17 41.45,22.95 v41.6,23.1
  Bottom 0.254: v41.6,23.1 41.6,20.6 36.75,15.8 14.9,15.8 14.5,16.2 14.5,16.81 J3.17
ATE_PA4/ADC1_4  (via drill 0.33)
  Top 0.254: U14.20 38.65,24.45 39.2,25 v39.2,27
  Bottom 0.254: v39.2,27 39.2,25 33.45,19.25 15.05,19.25 14.5,18.7 14.5,18.19 J3.18
ATE_PA5/ADC1_5  (via drill 0.33)
  Top 0.254: U14.21 38.15,25.05 v38.5,25.4
  Bottom 0.254: v38.5,25.4 32.8,19.7 14.2,19.7 13.2,18.7 13.2,18.16 J3.16
ATE_PA6/ADC1_6  (via drill 0.33)
  Top 0.254: U14.22 37.65,25.65 v38.3,26.3
  Bottom 0.254: v38.3,26.3 32.15,20.15 13.35,20.15 11.9,18.7 J3.14
ATE_PA7/ADC1_7  (via drill 0.33)
  Top 0.254: U14.23 37.15,26.25 v39,28.1
  Bottom 0.254: v39,28.1 31.45,20.6 12.5,20.6 10.6,18.7 10.6,18.17 J3.12
ATE_PA8
  Top 0.254: U14.41 25.25,16.95 21.6,13.3 12.6,13.3 10.8,11.5 10.8,10.8 J1.12
ATE_PA9
  Top 0.254: U14.42 25.45,16.45 21.8,12.8 13.3,12.8 12,11.5 12,10.73 J1.14
ATE_PA10
  Top 0.254: U14.43 25.65,15.95 22,12.3 14.2,12.3 13.3,11.4 13.3,10.76 J1.16
ATE_PB0/ADC1_8  (via drill 0.33)
  Top 0.254: U14.26 35.65,27.95 v35.5,28.1
  Bottom 0.254: v35.5,28.1 29.35,21.95 10.05,21.95 6.8,18.7 6.8,18.16 J3.6
ATE_PB1/ADC1_9  (via drill 0.33)
  Top 0.254: U14.27 35.15,27.35 v34.4,28.1
  Bottom 0.254: v34.4,28.1 28.7,22.4 9.3,22.4 5.6,18.7 5.6,18.18 J3.4
ATE_PB3
  Top 0.254: U14.55 35.65,7.75 35.1,7.2 12.4,7.2 11.9,7.7 J1.13
ATE_PB4
  Top 0.254: U14.56 36.15,7.55 35.3,6.7 11,6.7 10.6,7.1 10.6,9.33 J1.11
ATE_PB5
  Top 0.254: U14.57 36.65,7.35 35.5,6.2 9.6,6.2 9.4,6.4 9.4,9.33 J1.9
ATE_PB6
  Top 0.254: U14.58 37.15,7.15 35.7,5.7 8.5,5.7 8.1,6.1 J1.7
ATE_PB12
  Top 0.254: U14.33 22.85,20.95 22.4,21.4 11.43,21.4 J2.9
ATE_PC4/ADC1_14  (via drill 0.33)
  Top 0.254: U14.24 36.65,26.95 v37.8,28.1
  Bottom 0.254: v37.8,28.1 30.75,21.05 11.75,21.05 9.4,18.7 9.4,18.17 J3.10
ATE_PC5/ADC1_15  (via drill 0.33)
  Top 0.254: U14.25 36.15,27.75 v36.6,28.2
  Bottom 0.254: v36.6,28.2 29.9,21.5 10.9,21.5 8.1,18.7 J3.8
ATE_PC6
  Top 0.254: U14.37 24.45,18.95 20.8,15.3 9.4,15.3 5.6,11.5 5.6,10.68 J1.4
ATE_PC7
  Top 0.254: U14.38 24.65,18.45 21,14.8 10.2,14.8 6.8,11.4 6.8,10.66 J1.6
ATE_PC8
  Top 0.254: U14.39 24.85,17.95 21.2,14.3 10.9,14.3 8.1,11.5 J1.8
ATE_PC9
  Top 0.254: U14.40 25.05,17.45 21.4,13.8 11.7,13.8 9.4,11.5 9.4,10.67 J1.10
ATE_PC10
  Top 0.254: U14.51 33.65,9.55 33.3,9.2 17.9,9.2 16.5,10.6 15.75,10.6 J1.20
ATE_PC11
  Top 0.254: U14.52 34.15,9.05 33.8,8.7 16.38,8.7 J1.19
ATE_PC12
  Top 0.254: U14.53 34.65,8.45 34.4,8.2 14.8,8.2 14.5,8.5 14.5,9.31 J1.17
ATE_PC15
  Top 0.254: U14.50 33.15,10.15 32.7,9.7 18.6,9.7 16.5,11.8 14.8,11.8 14.5,11.5 14.5,10.69 J1.18
ATE_PD2
  Top 0.254: U14.54 35.15,8.05 34.8,7.7 13.7,7.7 13.2,8.2 13.2,9.34 J1.15
ATE_SPI2_MISO  (via drill 0.33)
  Top 0.254: U17.2 45.03,27.84 45.3,28.1 v45.3,30.7 | v15.9,31.5 14.62,31.5 U24.18 | U14.35 22.45,19.95 22,20.4 7.4,20.4 6.8,21 6.8,23.14 J2.5 | v3.5,26.8 v6.4,29.7
  Bottom 0.254: v45.3,30.7 45,31 16.5,31 v15.9,31.5 8.2,31.5 v6.4,29.7 | J2.5 6.83,22.43 6.3,21.9 3.2,21.9 2.7,22.4 2.7,26 v3.5,26.8
ATE_SPI2_MOSI  (via drill 0.33)
  Top 0.254: U17.5 52.3,25.3 v52.6,25.6 | U24.2 7.78,32.17 v7.5,31.9 2.7,27.1 2.7,22.4 3.2,21.9 5.6,21.9 | U14.36 22.25,19.45 21.8,19.9 6.5,19.9 5.6,20.8 5.6,21.9 | 5.6,21.9 5.6,23.12 J2.3
  Bottom 0.254: v52.6,25.6 51.6,25.6 45.7,31.5 16.9,31.5 16.2,32.2 7.8,32.2 v7.5,31.9
ATE_SPI2_SCK  (via drill 0.33)
  Top 0.254: 50.77,26.5 U17.6 52.27,26.57 v52.5,26.8 | U24.20 15.47,32.83 v15.8,33.2 15,34 7.5,34 6.4,32.9 6.4,31.4 2.2,27.2 v2.2,21.4 | U14.34 22.65,20.45 22.2,20.9 8.4,20.9 8.1,21.2 8.1,23.16 J2.7
  Bottom 0.254: v52.5,26.8 51.1,26.8 45.9,32 17,32 v15.8,33.2 | J2.7 8.1,23 6.5,21.4 v2.2,21.4
ATE_VIN0
  Top 0.254: U24.7 6.62,28.93 5.6,27.9 5.6,24.48 J2.4
ATE_VIN1
  Top 0.254: U24.8 7.47,28.27 6.8,27.6 6.8,24.46 J2.6
ATE_VIN2
  Top 0.254: U24.14 12.62,28.93 10.6,26.9 10.6,24.47 J2.12
ATE_VIN3
  Top 0.254: U24.13 13.18,28.27 11.8,26.9 11.8,24.54 J2.14
ATE_VIN4
  Top 0.254: U24.9 8.12,27.62 7.7,27.2 7.7,24.83 J2.8
ATE_VIN5
  Top 0.254: U24.10 8.8,25.8 9.4,25.2 9.4,24.47 J2.10
ATE_VIN6
  Top 0.254: U24.12 13.93,27.62 13.1,26.8 13.1,24.51 J2.16
ATE_VIN7
  Top 0.254: U24.11 14.6,24.59 J2.18
GND  (via drill 0.33)
  Top 0.254: C5.2 v49.1,15.7 C6.2 | U14.18 39.65,23.75 40.9,25 | 40.9,25 40.9,25.45 | 40.9,25 C2.2 | U14.12 43.55,18.95 43.9,19.3 44.75,19.3 C4.2 | J4.A1 96.62,20.15 J4.B12 | U14.31 33.15,24.05 32.7,24.5 31.4,24.5 31.4,25.65 C8.2 | U14.47 29.45,13.95 29.2,13.7 28.25,13.7 C1.2 | U14.63 39.65,10.35 40,10 40,9.05 C15.2 | U14.60 38.15,12.75 v38.1,12.9
  Top 0.813: C4.2 C9.2
  Top 1: v48.4,20 48.3,20 47.8,19.5 C9.2
  other vias: 26.7,13.5 41.8,25.5 44.9,12.4 50.3,13.7 50.3,17.7 50,19.9 44.2,18.3 67,17.2 67,18.2 67,19.2 80.4,19.2 80.4,18.2 80.4,17.2 82.2,17.2 82.2,18.2 82.2,19.2 84,17.2 84,18.2 84,19.2 85.8,17.2 85.8,18.2 85.8,19.2 68.8,17.2 68.8,18.2 68.8,19.2 65.2,17.2 65.2,18.2 65.2,19.2 63.4,17.2 63.4,18.2 63.4,19.2 48.7,24 21.7,24.8
  pour Bottom: 0,0 106,0 106,35 0,35
  pour Top: 0,35 0,0 106,0 106,35
MEM_CSN  (via drill 0.33)
  Top 0.254: 43.5,30.3 U17.1 | 43.5,30.3 43.5,32.3 44.1,32.9 48.25,32.9 R7.1 | U14.28 34.65,26.85 32.4,29.1 v32.4,30.3 | v42.5,30.3 43.5,30.3
  Bottom 0.254: v32.4,30.3 v42.5,30.3
N$1
  Top 0.254: U14.2 42.85,13.95 43.1,13.7 43.1,10.95 R10.2
N$2  (via drill 0.33)
  Top 0.6: C40.1 v60.9,17.9 | v63.3,14.1 U8.1
  Bottom 0.6: v60.9,17.9 60.9,15.7 v63.3,14.1
N$3
  Top 0.6: D7.C 57.4,20.1 L2.1 57.55,23.5 60.9,23.5 | U8.8 63.3,22.2 62,23.5 60.9,23.5 | C40.2 60.9,23.5
N$5
  Top 0.254: U14.6 44.2,15.95 45.7,17.5 45.95,17.5 X1.2 46.25,17.8 47.1,18.3 48.5,18.3 C5.1
N$6
  Top 0.254: U14.5 44.15,15.45 45.5,14.1 45.95,14.1 X1.1 46.05,13.8 46.5,13.8 47.1,13.1 48.5,13.1 C6.1
N$7
  Top 0.254: U14.3 43.05,14.45 43.6,13.9 43.6,11.5 44.2,10.9 46,10.9 46.3,10.6 R16.2
N$8  (via drill 0.33)
  Top 0.254: v48.2,2.3 48.3,2.2 96.8,2.2 103.4,8.8 104.55,8.8 D1.1 | v48.2,6.45 R17.1
  Bottom 0.254: v48.2,6.45 v48.2,2.3
N$9  (via drill 0.33)
  Top 0.254: v46.3,1.8 46.5,1.6 97,1.6 103.3,7.9 D1.2 | v46.3,6.45 R16.1
  Bottom 0.254: v46.3,6.45 v46.3,1.8
N$10
  Top 0.254: U14.30 33.65,25.15 33.4,25.4 C8.1
N$13
  Top 0.254: U14.4 43.25,14.95 44.1,14.1 44.1,12.1 44.7,11.5 47.7,11.5 48.2,11 R17.2
N$15  (via drill 0.33)
  Top 0.254: v44.4,1.8 45.1,1.1 97.1,1.1 103.1,7.1 D1.3 | v44.4,6.45 R10.1
  Bottom 0.254: v44.4,6.45 v44.4,1.8
N$23
  Top 0.254: U18.19 94.3,9.9 94.7,9.5 95.7,9.5 96,9.2 C18.1
N$27
  Top 0.254: U18.17 93.3,9.8 93,9.5 92.3,9.5 91.8,9 C7.1
N$28  (via drill 0.33)
  Top 0.6: U19.1 v80.3,13.9 | v77.9,17.9 C26.1
  Bottom 0.6: v80.3,13.9 77.9,16.3 v77.9,17.9
N$29
  Top 0.6: D2.C 74.4,21.1 L1.1 77.4,23.65 | C26.2 77.9,23.65 77.4,23.65 | U19.8 80.3,22.11 78.8,23.6 77.45,23.6 77.4,23.65
N$31
  Top 0.254: R28.1 R29.2 84.11,32.05 U19.5
N$32
  Top 0.254: U19.6 82.83,24.32 C25.1 R30.2
N$33
  Top 0.254: R30.1 80.85,29.2 C24.1
N$34
  Top 0.254: U19.4 84.11,11.85 C23.1
N$35
  Top 0.254: U19.3 82.83,9.91 R24.1 R25.2
N$39
  Top 0.254: R34.1 R35.2 67.11,32.05 U8.5
N$40
  Top 0.254: U8.6 65.83,24.29 C39.1 R36.2
N$41
  Top 0.254: R36.1 63.85,29.15 63.7,29.3 C38.1
N$42
  Top 0.254: U8.4 67.11,11.85 C37.1
N$43
  Top 0.254: U8.3 65.83,15.06 65.8,14.9 65.8,9.85 R1.1 R32.2
N$47
  Top 0.254: U24.15 17.27,29.57 C47.1 C48.1 C49.1 23,29.35 | 23,29.35 24.5,29.35 R37.2 | U25.5 23.06,29.29 23,29.35
N$49
  Top 0.254: R38.2 R37.1 24.96,27.19 U25.4
NRESET  (via drill 0.33)
  Top 0.254: U14.7 43.45,16.45 v43.9,16.9 | v43.3,1.9 42.4,1 23.8,1 22.8,2 22.8,2.8 22,3.6 20.57,3.6 J9.10
  Bottom 0.254: v43.9,16.9 43.3,16.3 v43.3,1.9
SWCLK  (via drill 0.33)
  Top 0.254: U14.49 32.65,10.45 32.4,10.2 21.7,10.2 v21.5,10.4
  Bottom 0.254: v21.5,10.4 21.5,6.2 19.9,4.6 17.1,4.6 16.8,4.3 16.8,3.71 J9.4
SWDIO  (via drill 0.33)
  Top 0.254: U14.46 26.35,14.45 25.9,14 25.9,11.5 25.5,11.1 v20.4,11.1
  Bottom 0.254: v20.4,11.1 20.4,6 19.5,5.1 15.9,5.1 15.5,4.7 15.5,3.67 J9.2
USB_CC1  (via drill 0.33)
  Top 0.254: J4.A5 93.05,22.15 v92.9,22.3 | D5.C v99.7,13.8 99.6,13.7 U18.5
  Bottom 0.254: v92.9,22.3 92.9,20.6 v99.7,13.8
USB_CC2  (via drill 0.33)
  Top 0.254: D6.C v99.7,11.1 99.7,12.3 98.8,13.2 U18.4
  Bottom 0.254: J4.B5 98.2,23.7 100.6,21.3 100.6,12 v99.7,11.1
USB_CC_INT  (via drill 0.33)
  Top 0.254: U18.13 88.4,12.7 v87.6,11.9 R23.1 | U14.62 39.15,6.75 v39.45,6.45 | v87.6,5.1 87.6,4.8 86,3.2 42.8,3.2 41.5,1.9 v39.2,1.9
  Bottom 0.254: v87.6,11.9 v87.6,5.1 | v39.45,6.45 39.45,6.35 39.2,6.3 v39.2,1.9
USB_DM  (via drill 0.33)
  Top 0.254: U14.44 25.85,15.45 24.7,14.3 24.7,12.9 v23.7,11.9 | v23.7,3 23.7,2.4 24,2.1 30.6,2.1 31.9,3.4 39.5,3.4 40.2,4.1 41.1,4.1 41.7,4.7 83.4,4.7 83.6,4.9 v83.6,5.1 | R8.2 v90.5,18.8
  Bottom 0.254: v23.7,11.9 v23.7,3 | v90.5,18.8 90.5,16.3 89.1,14.9 86.7,14.9 83.6,11.8 v83.6,5.1
USB_DP  (via drill 0.33)
  Top 0.254: U14.45 26.05,14.95 25.3,14.2 25.3,12.2 v25,11.9 | v24.9,3 30.7,3 31.6,3.9 39.3,3.9 40,4.6 40.9,4.6 41.5,5.2 82.4,5.2 v82.6,5.4 | R22.2 v87.8,18.9
  Bottom 0.254: v25,11.9 v24.9,3 | v87.8,18.9 87.8,16.6 82.6,11.4 v82.6,5.4
USB_VBUS  (via drill 0.33)
  Top 0.254: 92.2,21.6 92.2,22.6 93.75,24.15 J4.A9 96.62,24.15 J4.B4 | 92.2,21.6 92.2,21 92.9,20.3 R2.2 94.55,19.05 97.9,15.7 v97.9,14.4 | 92.2,21.6 92.25,21.65 J4.A4 96.62,21.65 J4.B9 | U18.2 97.55,12.2 C19.1 v99,11.9
  Bottom 0.254: v97.9,14.4 97.9,13 v99,11.9
USBC_DM  (via drill 0.33)
  Top 0.254: D4.C v90.5,23.1 R8.1 | J4.A7 94.45,23.15 v94.1,23.5
  Bottom 0.254: v90.5,23.1 91,23.6 94,23.6 v94.1,23.5 95.07,22.53 J4.B7
USBC_DP  (via drill 0.33)
  Top 0.254: R22.1 v87.8,23 D3.C | J4.A6 93.75,22.65 v93.5,22.9
  Bottom 0.254: J4.B6 95.7,23.3 94.6,24.4 89.2,24.4 v87.8,23 88.4,22.4 90.8,22.4 91.4,23 93.4,23 v93.5,22.9